# Altium project Guitare_amplifier_project.PrjPcb
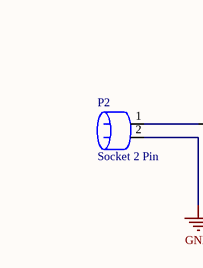
[diagram p0: 01_MCU_DSP..SchDoc, bottom left]
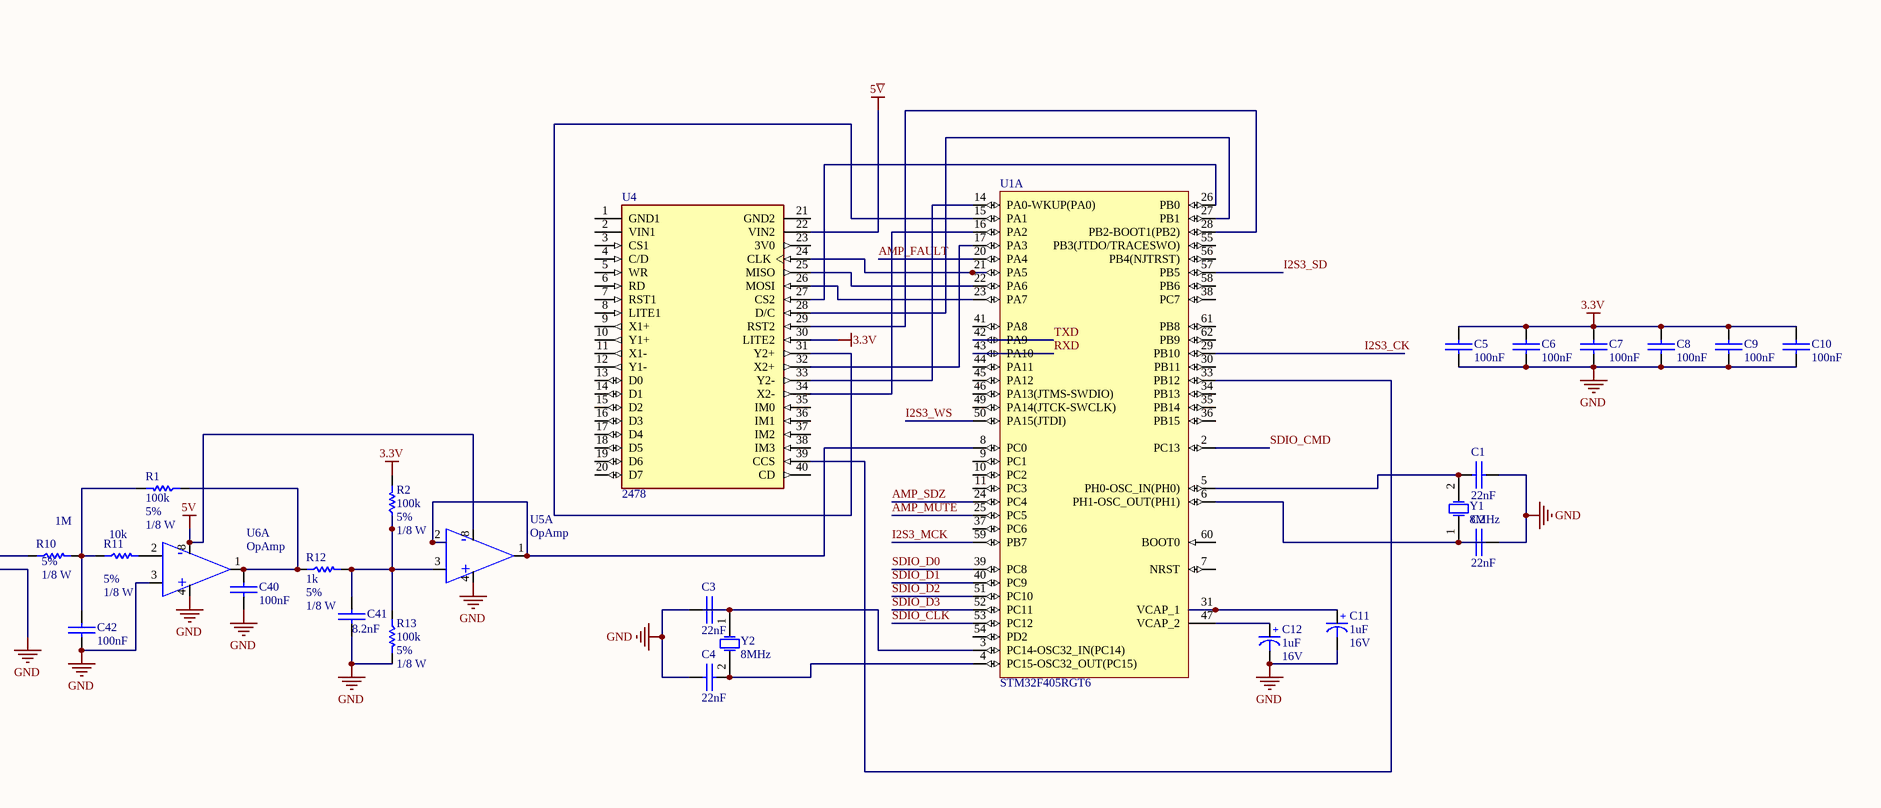
[diagram p1: 01_MCU_DSP..SchDoc, bottom right]
4 sheets, 79 parts. Net scope: global (net labels, ports and power ports of the same name join across sheets).
Board file: Guitare_amplifier_project.PcbDoc
Sheets:
  01_MCU_DSP..SchDoc
  02_DAC_Audio.SchDoc
  03_Power_Amp.SchDoc
  04_Power_Supply.SchDoc

## Sheet 01_MCU_DSP..SchDoc
size A3; SheetNumber: 1; SheetTotal: 6

### Parts
C1  22nF  [SMD_CAP_1206]
C2  22nF  [SMD_CAP_1206]
C3  22nF  [SMD_CAP_1206]
C4  22nF  [SMD_CAP_1206]
C5  100nF  [SMD_CAP_1206]
C6  100nF  [SMD_CAP_1206]
C7  100nF  [SMD_CAP_1206]
C8  100nF  [SMD_CAP_1206]
C9  100nF  [SMD_CAP_1206]
C10  100nF  [SMD_CAP_1206]
C11  Voltage: 16V  [cap 01]  (hidden comment: 1uF)
C12  Voltage: 16V  [cap 01]  (hidden comment: 1uF)
C40  100nF  [SMD_CAP_1206]
C41  8.2nF  [SMD_CAP_1206]
C42  100nF  [SMD_CAP_1206]
P2  Socket 2 Pin  [2pin]
R1  Tolerance: 5%  Power: 1/8 W  [RES 0805 (2012X06L)]  (hidden comment: 100k)
R2  Tolerance: 5%  Power: 1/8 W  [RES 0805 (2012X06L)]  (hidden comment: 100k)
R10  Tolerance: 5%  Power: 1/8 W  [RES 0805 (2012X06L)]  (hidden comment: 1M)
R11  Tolerance: 5%  Power: 1/8 W  [RES 0805 (2012X06L)]  (hidden comment: 10k)
R12  Tolerance: 5%  Power: 1/8 W  [RES 0805 (2012X06L)]  (hidden comment: 1k)
R13  Tolerance: 5%  Power: 1/8 W  [RES 0805 (2012X06L)]  (hidden comment: 100k)
U1  STM32F405RGT6  [STM-LQFP64_N]  (part A of 2)
U4  2478  [ADAFRUIT_2478]
U5  OpAmp  [SOIC8-Narrow]  (part A of 2)
U6  OpAmp  [SOIC8-Narrow]  (part A of 2)
Y1  8MHz  [XTAL Small]
Y2  8MHz  [XTAL Small]

### Nets
3.3V: C5.1(+) C6.1(+) C7.1(+) C8.1(+) C9.1(+) C10.1(+) R2.2 U4.30(LITE2)
5V: U5.8(V+) U6.8(V+)
5~{V}: U4.22(VIN2)
GND: C1.2(-) C2.2(-) C3.2(-) C4.2(-) C5.2(-) C6.2(-) C7.2(-) C8.2(-) C9.2(-) C10.2(-) C11.2(-) C12.2(-) C40.2(-) C41.2(-) C42.2(-) P2.2 R13.2 U5.4(V-) U6.3(Noninverter_Input) U6.4(V-)
AMP_FAULT: U1.20(PA4)
AMP_MUTE: U1.25(PC5)
AMP_SDZ: U1.24(PC4)
I2S3_CK: U1.29(PB10)
I2S3_MCK: U1.59(PB7)
I2S3_SD: U1.57(PB5)
I2S3_WS: U1.50(PA15(JTDI))
RXD: U1.43(PA10)
SDIO_CLK: U1.53(PC12)
SDIO_CMD: U1.2(PC13)
SDIO_D0: U1.39(PC8)
SDIO_D1: U1.40(PC9)
SDIO_D2: U1.51(PC10)
SDIO_D3: U1.52(PC11)
TXD: U1.42(PA9)
NetC1_1: C1.1(+) U1.5(PH0-OSC_IN(PH0)) Y1.2(OSC2)
NetC2_1: C2.1(+) U1.6(PH1-OSC_OUT(PH1)) Y1.1(OSC1)
NetC3_1: C3.1(+) U1.3(PC14-OSC32_IN(PC14)) Y2.1(OSC1)
NetC4_1: C4.1(+) U1.4(PC15-OSC32_OUT(PC15)) Y2.2(OSC2)
NetC11_1: C11.1(+) U1.31(VCAP_1)
NetC12_1: C12.1(+) U1.47(VCAP_2)
NetC40_1: C40.1(+) R1.1 R12.1 U6.1(Output)
NetC41_1: C41.1(+) R2.1 R12.2 R13.1 U5.3(Noninverter_Input)
NetC42_1: C42.1(+) R1.2 R10.2 R11.1
NetP2_1: P2.1 R10.1
NetR11_2: R11.2 U6.2(Inverter_Input)
NetU1_8: U1.8(PC0) U5.1(Output) U5.2(Inverter_Input)
NetU1_14: U1.14(PA0-WKUP(PA0)) U4.33(Y2-)
NetU1_15: U1.15(PA1) U4.31(Y2+)
NetU1_16: U1.16(PA2) U4.34(X2-)
NetU1_17: U1.17(PA3) U4.32(X2+)
NetU1_21: U1.21(PA5) U4.24(CLK)
NetU1_22: U1.22(PA6) U4.25(MISO)
NetU1_23: U1.23(PA7) U4.26(MOSI)
NetU1_26: U1.26(PB0) U4.27(CS2)
NetU1_27: U1.27(PB1) U4.28(D/C)
NetU1_28: U1.28(PB2-BOOT1(PB2)) U4.29(RST2)
NetU1_33: U1.33(PB12) U4.39(CCS)

Not connected (* = marked no-connect by the designer): U1 7(NRST) 9(PC1) 10(PC2) 11(PC3) 30(PB11) 34(PB13) 35(PB14) 36(PB15) 37(PC6) 38(PC7) 41(PA8) 44(PA11) 45(PA12) 46(PA13(JTMS-SWDIO)) 49(PA14(JTCK-SWCLK)) 54(PD2) 55(PB3(JTDO/TRACESWO)) 56(PB4(NJTRST)) 58(PB6) 60(BOOT0) 61(PB8) 62(PB9); U4 1(GND1) 2(VIN1) 3(CS1) 4(C/D) 5(WR) 6(RD) 7(RST1) 8(LITE1) 9(X1+) 10(Y1+) 11(X1-) 12(Y1-) 13(D0) 14(D1) 15(D2) 16(D3) 17(D4) 18(D5) 19(D6) 20(D7) 21(GND2) 23(3V0) 35(IM0) 36(IM1) 37(IM2) 38(IM3) 40(CD)

### Notes on the sheet
- (in symbol OpAmp, part A) -; +

### Library data of the parts
C1-C10 C40-C42 = Cap-Bipolar: Bipolar Capacitor; Voltage: 100V; Designer: Saeid Jorablo; Organazation: ControTec; Adding Date: 1387/12/20
  C1-C4: Value: 22nF
  C5-C10 C40 C42: Value: 100nF
  C41: Value: 8.2nF
C11 C12 = Cap-Polar: Polar Capacitor; Designer: Saeid Jorablo; Organazation: ControTec; Adding Date: 1387/12/20; Value: 1uF
P2 = Socket 2 Pin: Power Input
R1 R2 R10-R13 = Resistor
  R1 R2 R13: Value: 100k
  R10: Value: 1M
  R11: Value: 10k
  R12: Value: 1k
U1 = STM32F405RGT6: ARM Cortex-M4 32-bit MCU+FPU, 210 DMIPS, 1024 kB Flash, 192 kB Internal RAM, 51 I/Os, 64-pin LQFP, -40 to 85 degC, Tray; Manufacturer: STMicroelectronics; D/A Converter: 2x12-bit; FLASH Size (Prog) (kB): 1024; I/Os (High Current): 51; Internal RAM Size (kB): 192; Operating Frequency(F) (Processor speed) (MHz): 168; Supply Voltage(Vcc) max (V): 3.6; Supply Voltage(Vcc) min (V): 1.8; DatasheetVersion: Rev. 4; PackageVersion: Rev. 4, 06/2013; PackageReference: LQFP64; PackageDescription: 64-Pin Low Profile Quad Flat Package, 10 x 10 mm Body, 0.5 mm Pitch; Supplier 1: Digi-Key; Supplier Part Number 1: 497-11767-ND; Supplier 2: Farnell; Supplier Part Number 2: 2064363; Supplier 3: Newark; Supplier Part Number 3: 73T2329; Supplier 4: Mouser; Supplier Part Number 4: 511-STM32F405RGT6; Core: ARM Cortex-M4; Packing: Tray; Mounting Technology: Surface Mount; PartNumber: STM32F405RGT6; ComponentLink1Description: Manufacturer URL; ComponentLink1URL: http://www.st.com/web/en/home.html; ComponentLink2Description: Datasheet; ComponentLink2URL: http://www.st.com/st-web-ui/static/active/en/resource/technical/document/datasheet/DM00037051.pdf; ComponentLink3Description: Package Specification; ComponentLink3URL: http://www.st.com/st-web-ui/static/active/en/resource/technical/document/datasheet/DM00037051.pdf
U4 = 2478: Resistive Graphic LCD Display Module Red, Green, Blue (RGB) TFT - Color Parallel, 8-Bit, SPI 2.4 (60.96mm) 240 x 320; MF: Adafruit Industries; Package: NON STANDARD Adafruit; Price: None; Value: *; SnapEDA_Link: https://www.snapeda.com/parts/2478/Adafruit+Industries+LLC/view-part/?ref=snap; MP: 2478; Availability: In Stock; Check_prices: https://www.snapeda.com/parts/2478/Adafruit+Industries+LLC/view-part/?ref=eda
U5 U6 = OpAmp: Dual Low Noise Operational Amplifier (OpAmp)
Y1 Y2 = XTAL: XTAL Crystal; Company: E.P.I.L; Design Date: 11/04/2011; Value: 8MHz

## Sheet 02_DAC_Audio.SchDoc
size A4; SheetNumber: 2; SheetTotal: 4
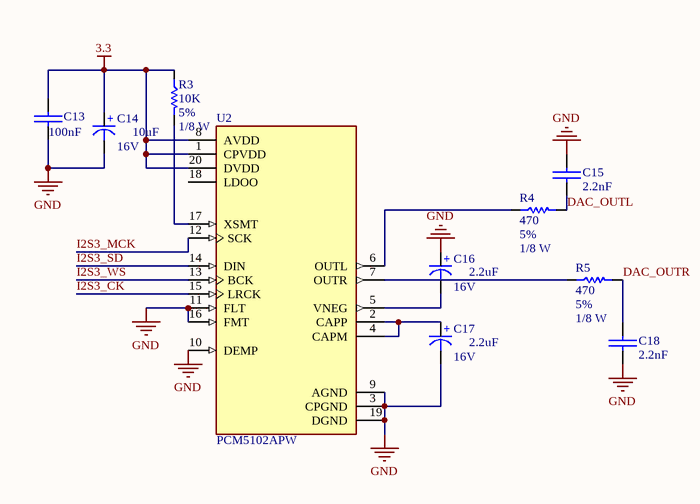
[diagram p2: 02_DAC_Audio.SchDoc]

### Parts
C13  100nF  [SMD_CAP_1206]
C14  Voltage: 16V  [cap 01]  (hidden comment: 10uF)
C15  2.2nF  [SMD_CAP_1206]
C16  Voltage: 16V  [cap 01]  (hidden comment: 2.2uF)
C17  Voltage: 16V  [cap 01]  (hidden comment: 2.2uF)
C18  2.2nF  [SMD_CAP_1206]
R3  Tolerance: 5%  Power: 1/8 W  [RES 0805 (2012X06L)]  (hidden comment: 10K)
R4  Tolerance: 5%  Power: 1/8 W  [RES 0805 (2012X06L)]  (hidden comment: 470)
R5  Tolerance: 5%  Power: 1/8 W  [RES 0805 (2012X06L)]  (hidden comment: 470)
U2  PCM5102APW  [SOP65P640X120-20N]

### Nets
3.3: C13.1(+) C14.1(+) R3.1 U2.1(CPVDD) U2.8(AVDD) U2.20(DVDD)
GND: C13.2(-) C14.2(-) C15.1(+) C16.1(+) C17.2(-) C18.2(-) U2.3(CPGND) U2.9(AGND) U2.10(DEMP) U2.11(FLT) U2.16(FMT) U2.19(DGND)
DAC_OUTL: C15.2(-) R4.2
DAC_OUTR: C18.1(+) R5.2
I2S3_CK: U2.15(LRCK)
I2S3_MCK: U2.12(SCK)
I2S3_SD: U2.14(DIN)
I2S3_WS: U2.13(BCK)
NetC16_2: C16.2(-) U2.5(VNEG)
NetC17_1: C17.1(+) U2.2(CAPP) U2.4(CAPM)
NetR3_2: R3.2 U2.17(XSMT)
NetR4_1: R4.1 U2.6(OUTL)
NetR5_1: R5.1 U2.7(OUTR)

Not connected (* = marked no-connect by the designer): U2 18(LDOO)

### Library data of the parts
C13 C15 C18 = Cap-Bipolar: as C1 on sheet 01_MCU_DSP.; Adding Date: 1387/12/20
  C13: Value: 100nF
  C15 C18: Value: 2.2nF
C14 C16 C17 = Cap-Polar: as C11 on sheet 01_MCU_DSP.; Adding Date: 1387/12/20
  C14: Value: 10uF
  C16 C17: Value: 2.2uF
R3-R5 = Resistor
  R3: Value: 10K
  R4 R5: Value: 470
U2 = PCM5102APW: 2VRMS DirectPathâ„¢, DAC estÃ©reo de Ã¡udio de 112dB com interface PCM de 32 bits e 384kHz 20-TSSOP -25 a 85; MF: Texas Instruments; Purchase-URL: https://pricing.snapeda.com/search/part/PCM5102APW/?ref=eda; MP: PCM5102APW; Value: *; Availability: In Stock; Check_prices: https://www.snapeda.com/parts/PCM5102APW/Texas+Instruments/view-part/?ref=eda; SnapEDA_Link: https://www.snapeda.com/parts/PCM5102APW/Texas+Instruments/view-part/?ref=snap; Price: None; Package: TSSOP-20 Texas Instruments

## Sheet 03_Power_Amp.SchDoc
size A4; SheetNumber: 3; SheetTotal: 4
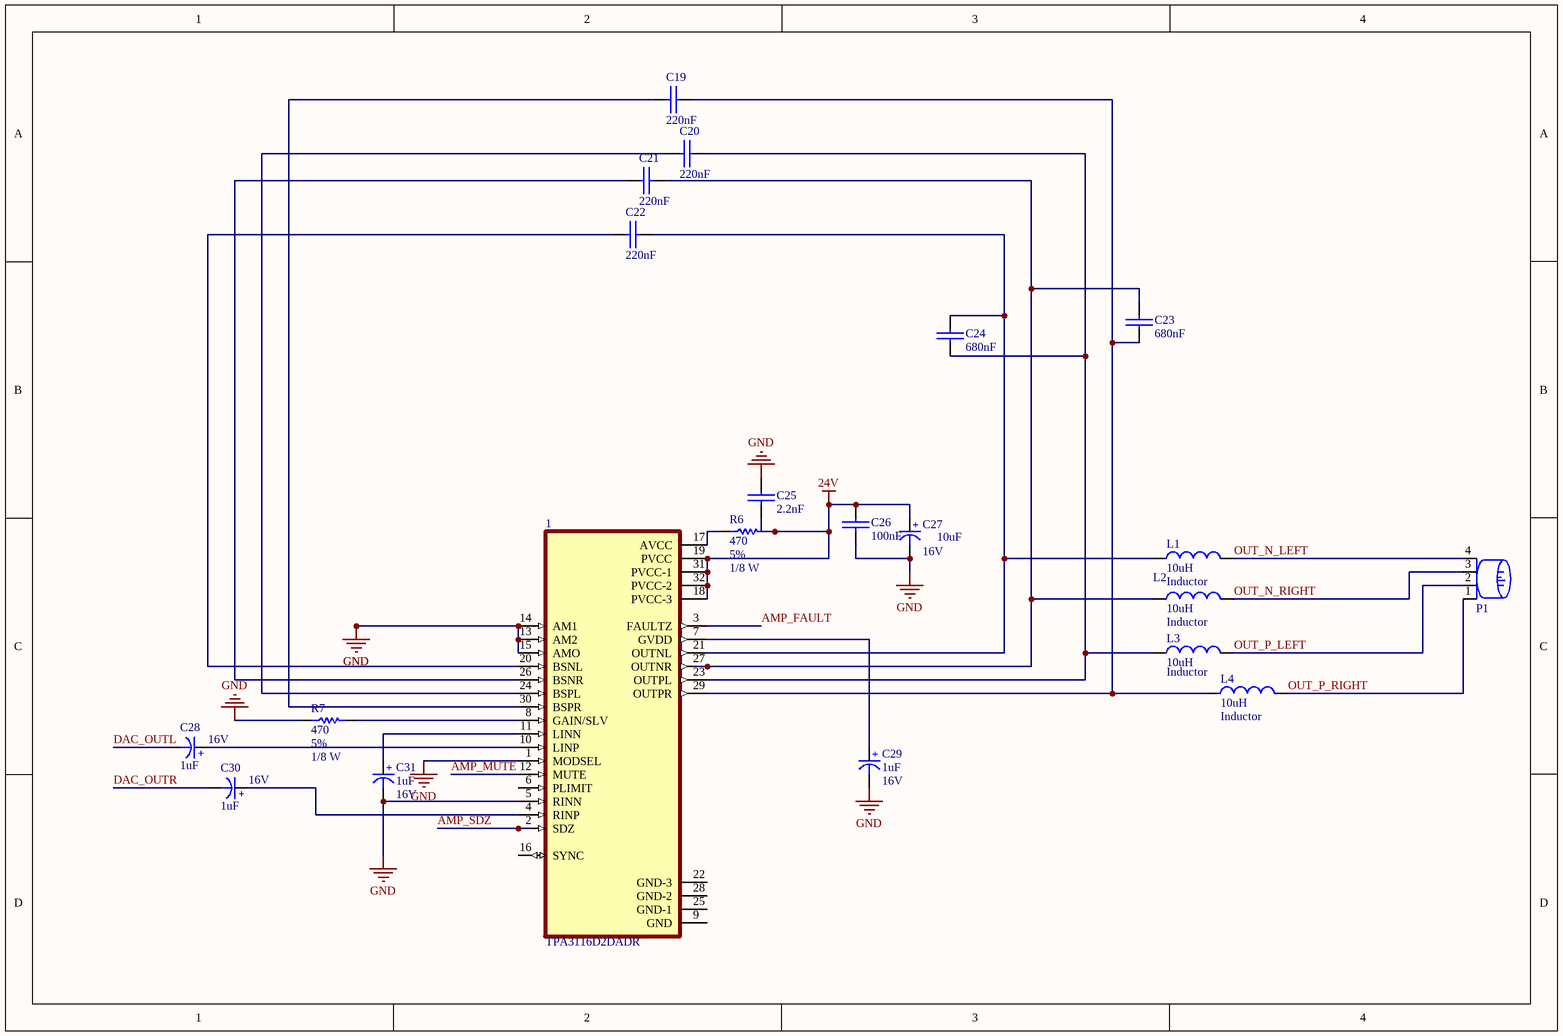
[diagram p3: 03_Power_Amp.SchDoc]

### Parts
1  TPA3116D2DADR  [SOP65P810X115-33N]
C19  220nF  [SMD_CAP_1206]
C20  220nF  [SMD_CAP_1206]
C21  220nF  [SMD_CAP_1206]
C22  220nF  [SMD_CAP_1206]
C23  680nF  [SMD_CAP_1206]
C24  680nF  [SMD_CAP_1206]
C25  2.2nF  [SMD_CAP_1206]
C26  100nF  [SMD_CAP_1206]
C27  Voltage: 16V  [cap 01]  (hidden comment: 10uF)
C28  Voltage: 16V  [cap 01]  (hidden comment: 1uF)
C29  Voltage: 16V  [cap 01]  (hidden comment: 1uF)
C30  Voltage: 16V  [cap 01]  (hidden comment: 1uF)
C31  Voltage: 16V  [cap 01]  (hidden comment: 1uF)
L1  Inductor  value 10uH  [INDC1608L]
L2  Inductor  value 10uH  [INDC1608L]
L3  Inductor  value 10uH  [INDC1608L]
L4  Inductor  value 10uH  [INDC1608L]
P1  Socket 4 Pin  [4pin]  (value not drawn)
R6  Tolerance: 5%  Power: 1/8 W  [RES 0805 (2012X06L)]  (hidden comment: 470)
R7  Tolerance: 5%  Power: 1/8 W  [RES 0805 (2012X06L)]  (hidden comment: 470)

### Nets
24V: 1.18(PVCC-3) 1.19(PVCC) 1.31(PVCC-1) 1.32(PVCC-2) C25.2(-) C26.2(-) C27.1(+) R6.2
GND: 1.1(MODSEL) 1.5(RINN) 1.13(AM2) 1.14(AM1) 1.15(AMO) C25.1(+) C26.1(+) C27.2(-) C29.2(-) C31.2(-) R7.1
AMP_FAULT: 1.3(FAULTZ)
AMP_MUTE: 1.12(MUTE)
AMP_SDZ: 1.2(SDZ)
DAC_OUTL: C28.2(-)
DAC_OUTR: C30.2(-)
OUT_N_LEFT: L1.2 P1.4
OUT_N_RIGHT: L2.2 P1.3
OUT_P_LEFT: L3.2 P1.2
OUT_P_RIGHT: L4.2 P1.1
Net1_4: 1.4(RINP) C30.1(+)
Net1_7: 1.7(GVDD) C29.1(+)
Net1_8: 1.8(GAIN/SLV) R7.2
Net1_10: 1.10(LINP) C28.1(+)
Net1_11: 1.11(LINN) C31.1(+)
Net1_17: 1.17(AVCC) R6.1
Net1_20: 1.20(BSNL) C22.2(-)
Net1_21: 1.21(OUTNL) C22.1(+) C24.2(-) L1.1
Net1_23: 1.23(OUTPL) C20.1(+) C24.1(+) L3.1
Net1_24: 1.24(BSPL) C20.2(-)
Net1_26: 1.26(BSNR) C21.2(-)
Net1_27: 1.27(OUTNR) C21.1(+) C23.2(-) L2.1
Net1_29: 1.29(OUTPR) C19.1(+) C23.1(+) L4.1
Net1_30: 1.30(BSPR) C19.2(-)

Not connected (* = marked no-connect by the designer): 1 6(PLIMIT) 9(GND) 16(SYNC) 22(GND-3) 25(GND-1) 28(GND-2)

### Library data of the parts
1 = TPA3116D2DADR: 50-W stereo, 100-W mono, 4.5- to 26-V supply, analog input Class-D audio amplifier w/ SpeakerGuardâ„¢; MF: Texas Instruments; SnapEDA_Link: https://www.snapeda.com/parts/TPA3116D2DADR/Texas+Instruments/view-part/?ref=snap; Package: HTSSOP-32 Texas Instruments; Value: *; MP: TPA3116D2DADR; Check_prices: https://www.snapeda.com/parts/TPA3116D2DADR/Texas+Instruments/view-part/?ref=eda
C19-C26 = Cap-Bipolar: as C1 on sheet 01_MCU_DSP.; Adding Date: 1387/12/20
  C19-C22: Value: 220nF
  C23 C24: Value: 680nF
  C25: Value: 2.2nF
  C26: Value: 100nF
C27-C31 = Cap-Polar: as C11 on sheet 01_MCU_DSP.; Adding Date: 1387/12/20
  C27: Value: 10uF
  C28-C31: Value: 1uF
L1-L4 = Inductor: Code_IEC: 1005; Published: 8-Jun-2000; LatestRevisionDate: 29-May-2009; LatestRevisionNote: IPC-7351 Footprint Added.; PackageReference: 0402-A; Publisher: Altium Limited; PackageDescription: Chip Inductor; Code_JEITA: 0402
P1 = Socket 4 Pin: Power Input
R6 R7 = Resistor: Value: 470

## Sheet 04_Power_Supply.SchDoc
size A4; SheetNumber: 4; SheetTotal: 6
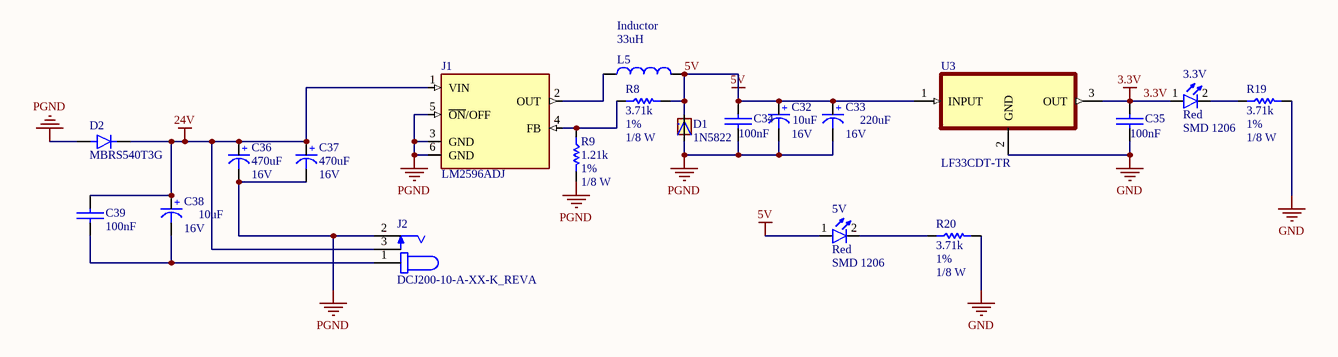
[diagram p4: 04_Power_Supply.SchDoc]

### Parts
3.3V  Size: SMD 1206  [LED SMD 1206]  (hidden comment: Red)
5V  Size: SMD 1206  [LED SMD 1206]  (hidden comment: Red)
C32  Voltage: 16V  [cap 01]  (hidden comment: 10uF)
C33  Voltage: 16V  [cap 01]  (hidden comment: 220uF)
C34  100nF  [SMD_CAP_1206]
C35  100nF  [SMD_CAP_1206]
C36  Voltage: 16V  [cap 01]  (hidden comment: 470uF)
C37  Voltage: 16V  [cap 01]  (hidden comment: 470uF)
C38  Voltage: 16V  [cap 01]  (hidden comment: 10uF)
C39  100nF  [SMD_CAP_1206]
D1  1N5822  [DIOAD2120W130L950D530P]
D2  MBRS540T3G  [DIOM7959X261N]
J1  LM2596ADJ  [LM2596ADJ]
J2  DCJ200-10-A-XX-K_REVA  [GCT_DCJ200-10-A-XX-K_REVA]
L5  Inductor  value 33uH  [INDC1608L]
R8  Tolerance: 1%  Power: 1/8 W  [RES 0805 (2012X06L)]  (hidden comment: 3.71k)
R9  Tolerance: 1%  Power: 1/8 W  [RES 0805 (2012X06L)]  (hidden comment: 1.21k)
R19  Tolerance: 1%  Power: 1/8 W  [RES 0805 (2012X06L)]  (hidden comment: 3.71k)
R20  Tolerance: 1%  Power: 1/8 W  [RES 0805 (2012X06L)]  (hidden comment: 3.71k)
U3  LF33CDT-TR  [TO228P972X240-3N]

### Nets
3.3V: 3.3V.1(A) C35.2(-) U3.3(OUT)
5V: 5V.1(A) C32.1(+) C33.1(+) C34.2(-) D1.C L5.2 R8.2 U3.1(INPUT)
24V: C36.1(+) C37.1(+) C38.1(+) C39.2(-) D2.1(C) J1.1(VIN) J2.3
GND: C35.1(+) R19.2 R20.2 U3.2(GND)
PGND: C32.2(-) C33.2(-) C34.1(+) C36.2(-) C37.2(-) D1.A D2.2(A) J1.3(GND) J1.5(~{ON}/OFF) J1.6(GND) J2.2 R9.2
Net3.3V_2: 3.3V.2(K) R19.1
Net5V_2: 5V.2(K) R20.1
NetC38_2: C38.2(-) C39.1(+) J2.1
NetJ1_2: J1.2(OUT) L5.1
NetJ1_4: J1.4(FB) R8.1 R9.1

### Library data of the parts
3.3V 5V = LED: Designer: Saeid Jorablo; Organazation: ControTec; Adding Date: 1387/12/22; Color: Red
C32 C33 C36-C38 = Cap-Polar: as C11 on sheet 01_MCU_DSP.; Adding Date: 1387/12/20
  C32 C38: Value: 10uF
  C33: Value: 220uF
  C36 C37: Value: 470uF
C34 C35 C39 = Cap-Bipolar: as C1 on sheet 01_MCU_DSP.; Adding Date: 1387/12/20; Value: 100nF
D1 = 1N5822: Schottky, DO-201, 40V, 3A, 150Â°C; MF: Diotec Semiconductor; SnapEDA_Link: https://www.snapeda.com/parts/1N5822/Diotec/view-part/?ref=snap; Package: DO-201 Diotec; Value: *; MP: 1N5822; Check_prices: https://www.snapeda.com/parts/1N5822/Diotec/view-part/?ref=eda
D2 = MBRS540T3G: Diode Schottky 40 V 5A Surface Mount SMC; MF: ON Semiconductor; SnapEDA_Link: https://www.snapeda.com/parts/MBRS540T3G/Onsemi/view-part/?ref=snap; Package: SMC-2 ON Semiconductor; Value: *; MP: MBRS540T3G; Check_prices: https://www.snapeda.com/parts/MBRS540T3G/Onsemi/view-part/?ref=eda
J1 = LM2596ADJ: Convertidor de potencia SIMPLE SWITCHER; MF: Texas Instruments; MP: LM2596-ADJ; SnapEDA_Link: https://www.snapeda.com/parts/LM2596-ADJ/Texas+Instruments/view-part/?ref=snap; Package: None; Value: *; Check_prices: https://www.snapeda.com/parts/LM2596-ADJ/Texas+Instruments/view-part/?ref=eda
J2 = DCJ200-10-A-XX-K_REVA: Power Barrel Connector Jack 2.05mm ID (0.081), 5.50mm OD (0.217) Through Hole, Right Angle; MF: Global Connector Technology; MP: DCJ200-10-A-K1-K; SnapEDA_Link: https://www.snapeda.com/parts/DCJ200-10-A-K1-K/Global+Connector+Technology/view-part/?ref=snap; Package: None; Value: *; Check_prices: https://www.snapeda.com/parts/DCJ200-10-A-K1-K/Global+Connector+Technology/view-part/?ref=eda
L5 = Inductor: Code_IEC: 1005; Published: 8-Jun-2000; LatestRevisionDate: 29-May-2009; LatestRevisionNote: IPC-7351 Footprint Added.; PackageReference: 0402-A; Publisher: Altium Limited; PackageDescription: Chip Inductor; Code_JEITA: 0402
R8 R9 R19 R20 = Resistor
  R8 R19 R20: Value: 3.71k
  R9: Value: 1.21k
U3 = LF33CDT-TR: Linear Voltage Regulator IC Positive Fixed 1 Output 500mA DPAK; MF: STMicroelectronics; Package: TO-252-3 STMicroelectronics; Price: None; Check_prices: https://www.snapeda.com/parts/LF33CDT-TR/STMicroelectronics/view-part/?ref=eda; Value: *; SnapEDA_Link: https://www.snapeda.com/parts/LF33CDT-TR/STMicroelectronics/view-part/?ref=snap; MP: LF33CDT-TR; Availability: In Stock; Purchase-URL: https://pricing.snapeda.com/search/part/LF33CDT-TR/?ref=eda

## Nets that join several sheets
3.3V: 01_MCU_DSP. (8 pins), 04_Power_Supply (3.3V.1 C35.2 U3.3)
5V: 01_MCU_DSP. (U5.8 U6.8), 04_Power_Supply (8 pins)
24V: 03_Power_Amp (8 pins), 04_Power_Supply (7 pins)
GND: 01_MCU_DSP. (20 pins), 02_DAC_Audio (12 pins), 03_Power_Amp (11 pins), 04_Power_Supply (C35.1 R19.2 R20.2 U3.2)
AMP_FAULT: 01_MCU_DSP. (U1.20), 03_Power_Amp (1.3)
AMP_MUTE: 01_MCU_DSP. (U1.25), 03_Power_Amp (1.12)
AMP_SDZ: 01_MCU_DSP. (U1.24), 03_Power_Amp (1.2)
DAC_OUTL: 02_DAC_Audio (C15.2 R4.2), 03_Power_Amp (C28.2)
DAC_OUTR: 02_DAC_Audio (C18.1 R5.2), 03_Power_Amp (C30.2)
I2S3_CK: 01_MCU_DSP. (U1.29), 02_DAC_Audio (U2.15)
I2S3_MCK: 01_MCU_DSP. (U1.59), 02_DAC_Audio (U2.12)
I2S3_SD: 01_MCU_DSP. (U1.57), 02_DAC_Audio (U2.14)
I2S3_WS: 01_MCU_DSP. (U1.50), 02_DAC_Audio (U2.13)